# EAGLE design PortArrayModule (EAGLE 8.6.1)
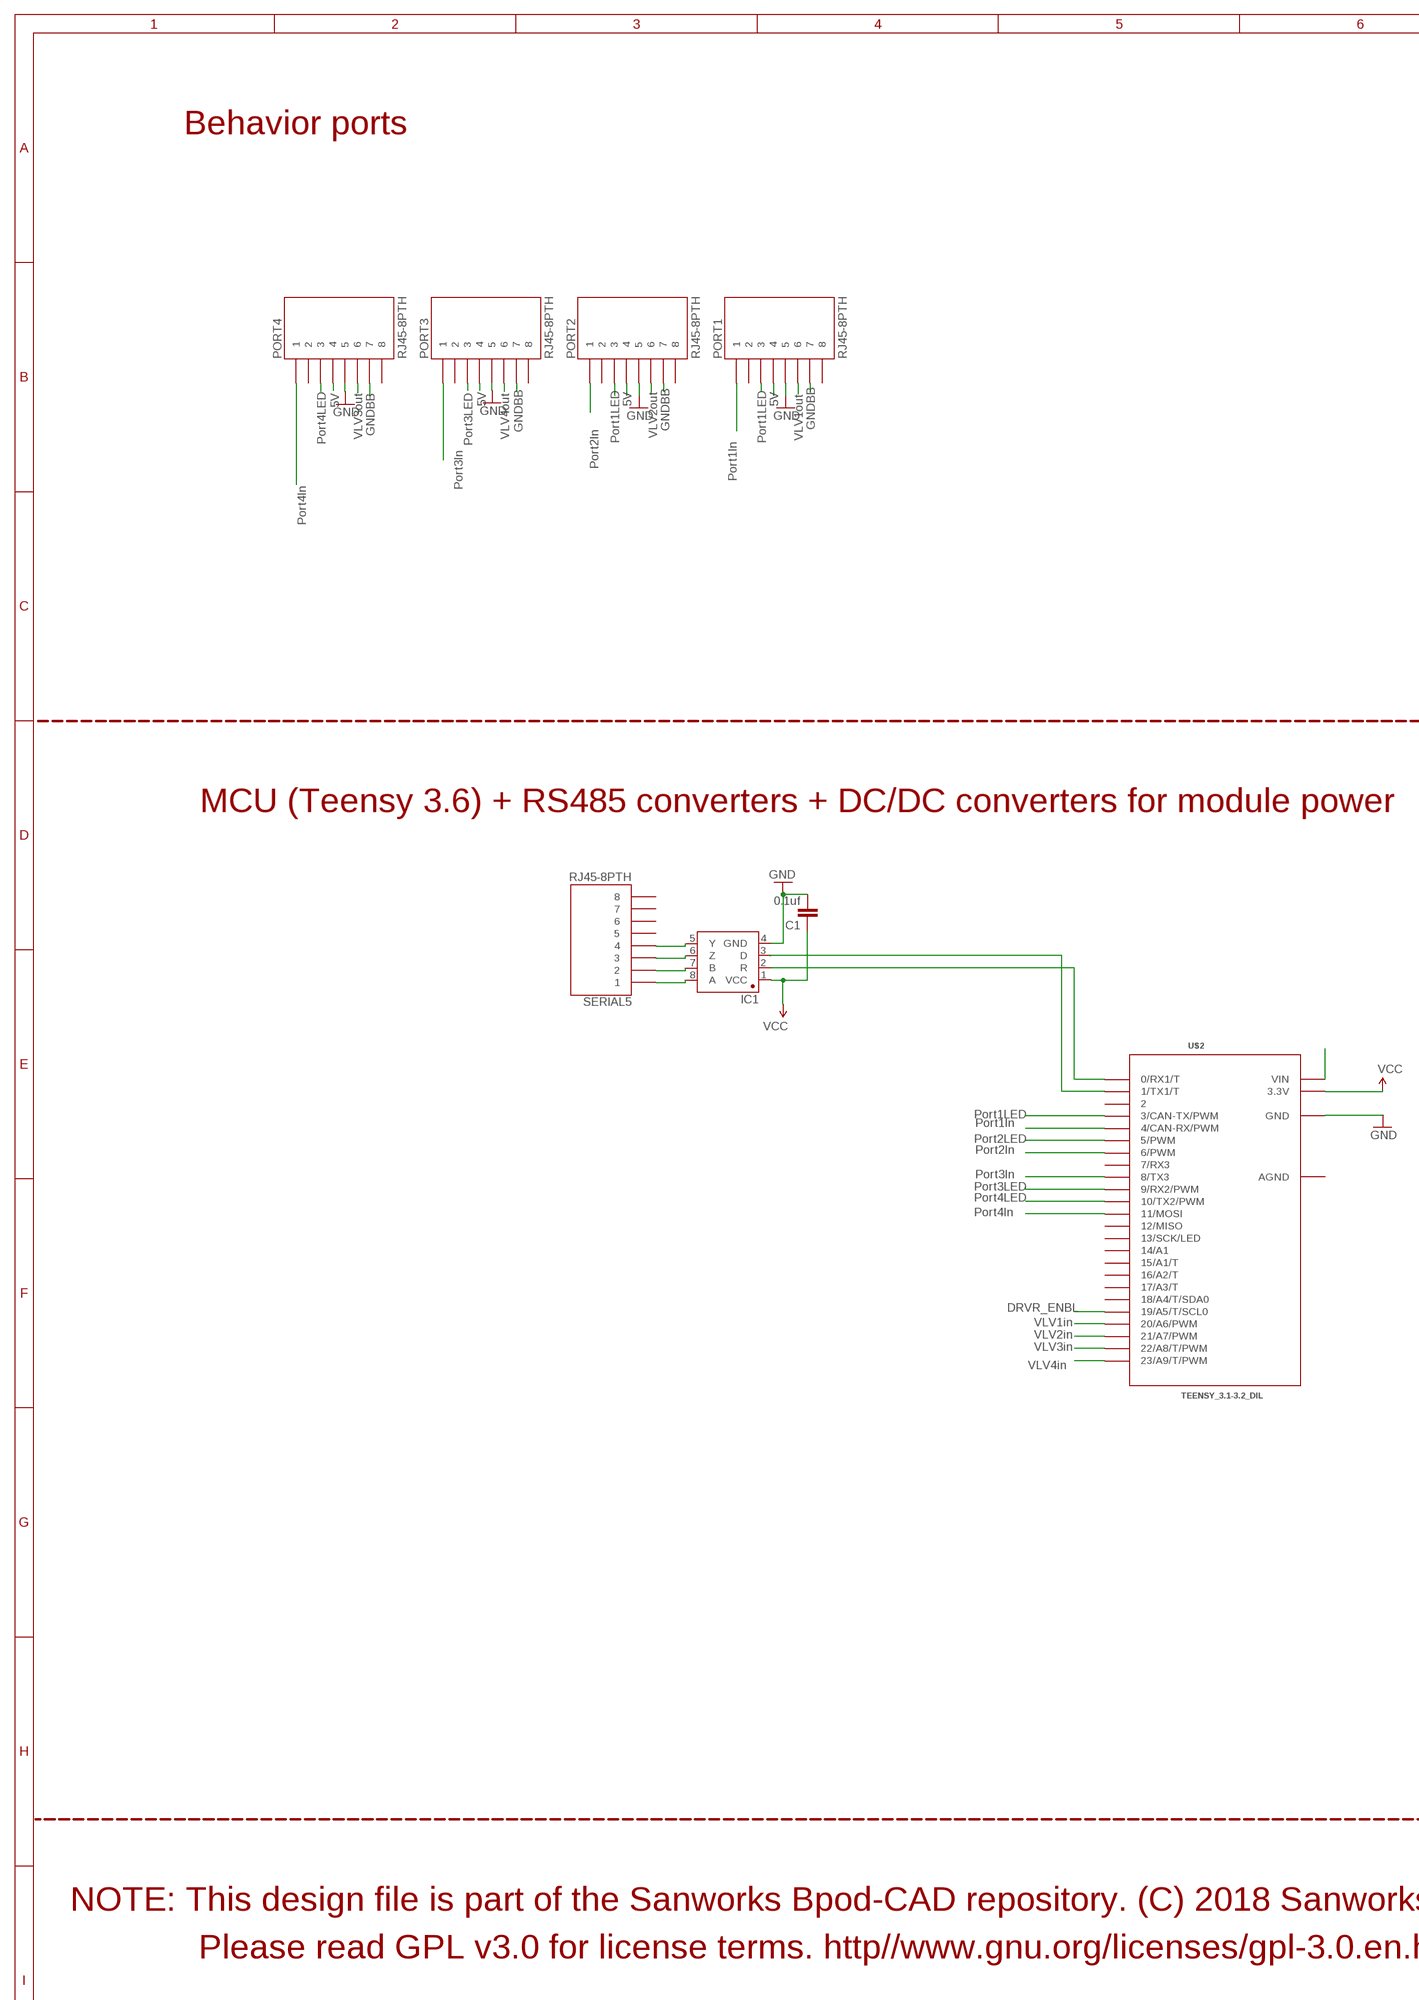
[diagram p0: schematic, sheet 1, part 1 of 2]
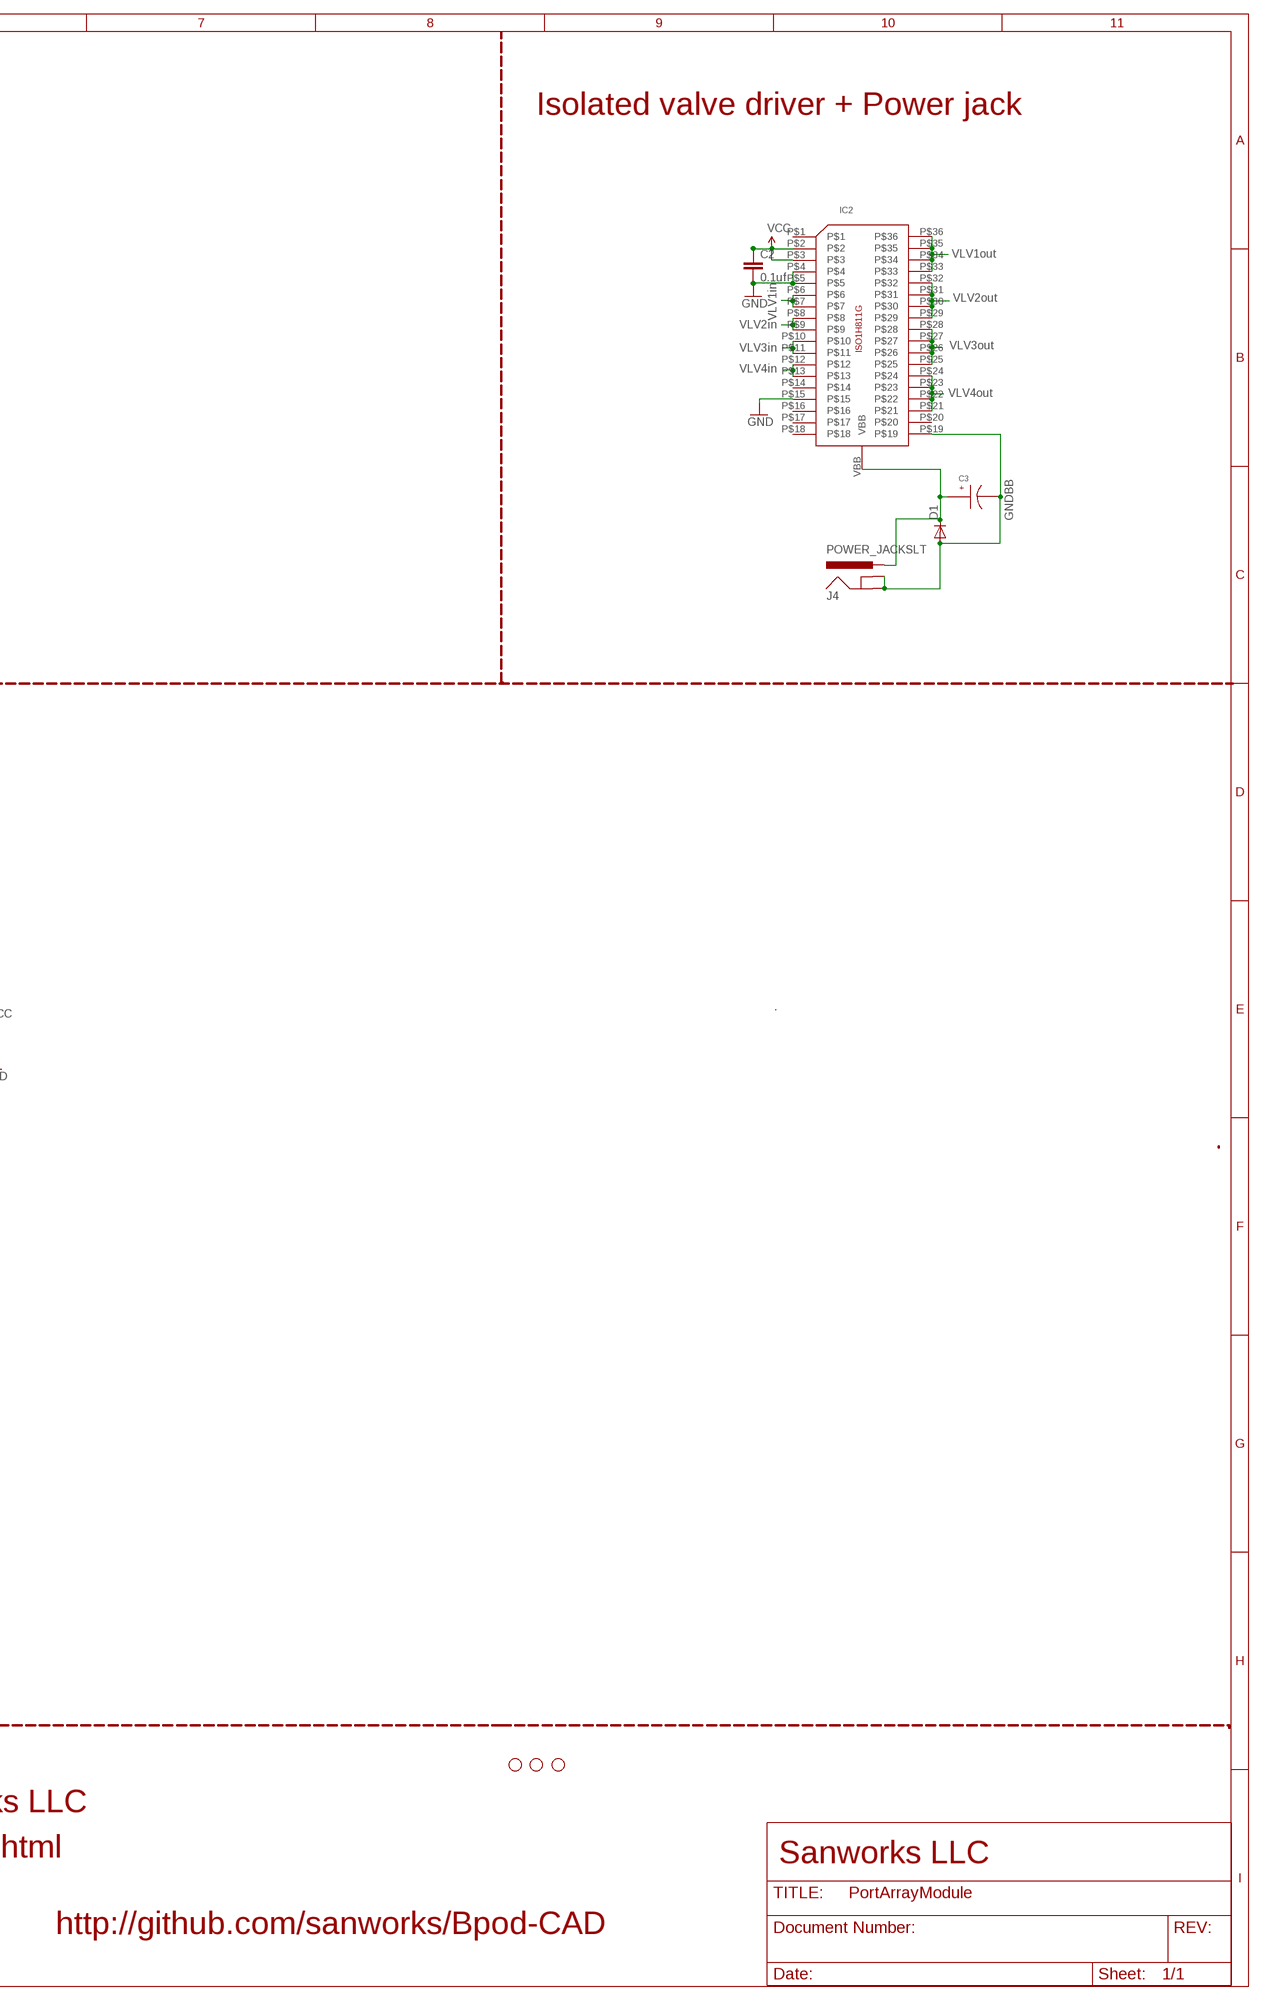
[diagram p1: schematic, sheet 1, part 2 of 2]

## Parts
C1  0.1uf  CAP1206  [1206@1]
C2  0.1uf  CAP1206  [1206@1]
C3  EEE-FK1H100UR  [EEE-FK1H100UR]
D1  DIODE-DO214AA  [DO214AA]
IC1  SN65HVD31DR  [SO08]
IC2  ISO1H811G  [ISO1H811G]
J4  POWER_JACKSLT  [POWER_JACK_SLOT]
JP3  STAND-OFF  [STAND-OFF]
JP4  STAND-OFF  [STAND-OFF]
JP5  STAND-OFF  [STAND-OFF]
PORT1  RJ45-8PTH  [RJ45-8]
PORT2  RJ45-8PTH  [RJ45-8]
PORT3  RJ45-8PTH  [RJ45-8]
PORT4  RJ45-8PTH  [RJ45-8]
SERIAL5  RJ45-8PTH  [RJ45-8]
U$2  TEENSY_3.1-3.2_DIL  [TEENSY_3.0-3.2&LC_DIL]

## Nets
5V: PORT1.4 PORT2.4 PORT3.4 PORT4.4 U$2.VIN
DRVR_ENBL: U$2.19/A5(19/A5/T/SCL0)
GND: C1.2 C2.2 IC1.4(GND) IC2.P$4 IC2.P$5 IC2.P$15 PORT1.5 PORT2.5 PORT3.5 PORT4.5 U$2.GND
GNDBB: C3.CATHODE D1.A IC2.P$19 J4.GND@1(GNDBREAK) J4.GND@2(GND) PORT1.7 PORT2.7 PORT3.7 PORT4.7
N$1: IC1.8(A) SERIAL5.1
N$2: IC1.7(B) SERIAL5.2
N$3: IC1.6(Z) SERIAL5.3
N$4: IC1.5(Y) SERIAL5.4
N$5: IC1.3(D) U$2.1(1/TX1/T)
N$6: IC1.2(R) U$2.0(0/RX1/T)
PORT1IN: PORT1.1 U$2.4(4/CAN-RX/PWM)
PORT1LED: PORT1.3 U$2.3(3/CAN-TX/PWM)
PORT2IN: PORT2.1 U$2.6(6/PWM)
PORT2LED: PORT2.3 U$2.5(5/PWM)
PORT3IN: PORT3.1 U$2.8(8/TX3)
PORT3LED: PORT3.3 U$2.9(9/RX2/PWM)
PORT4IN: PORT4.1 U$2.11(11/MOSI)
PORT4LED: PORT4.3 U$2.10(10/TX2/PWM)
VBB: C3.ANODE D1.C IC2.VBB J4.PWR
VCC: C1.1 C2.1 IC1.1(VCC) IC2.P$2 IC2.P$3 U$2.3.3V
VLV1IN: IC2.P$6 IC2.P$7 U$2.20/A6(20/A6/PWM)
VLV1OUT: IC2.P$33 IC2.P$34 IC2.P$35 IC2.P$36 PORT1.6
VLV2IN: IC2.P$8 IC2.P$9 U$2.21/A7(21/A7/PWM)
VLV2OUT: IC2.P$29 IC2.P$30 IC2.P$31 IC2.P$32 PORT2.6
VLV3IN: IC2.P$12 IC2.P$13 U$2.23/A9(23/A9/T/PWM)
VLV3OUT: IC2.P$21 IC2.P$22 IC2.P$23 IC2.P$24 PORT3.6
VLV4IN: IC2.P$10 IC2.P$11 U$2.22/A8(22/A8/T/PWM)
VLV4OUT: IC2.P$25 IC2.P$26 IC2.P$27 IC2.P$28 PORT4.6
Unconnected: IC2.P$1 IC2.P$14 IC2.P$16 IC2.P$17 IC2.P$18 IC2.P$20 PORT1.2 PORT1.8 PORT2.2 PORT2.8 PORT3.2 PORT3.8 PORT4.2 PORT4.8 SERIAL5.5 SERIAL5.6 SERIAL5.7 SERIAL5.8 U$2.2 U$2.7(7/RX3) U$2.12(12/MISO) U$2.13(13/SCK/LED) U$2.14/A0(14/A1) U$2.15/A1(15/A1/T) U$2.16/A2(16/A2/T) U$2.17/A3(17/A3/T) U$2.18/A4(18/A4/T/SDA0)

## Notes on the sheet
- Isolated valve driver + Power jack
- Behavior ports
- VLV1out
- VLV2out
- VLV1in
- VLV2in
- VLV3in | VLV3out
- VLV4in
- 5V | 5V | 5V | 5V
- VLV4out
- GNDBB | GNDBB | GNDBB
- GNDBB | VLV2out
- VLV3out | VLV4out | VLV1out
- Port4LED | Port3LED | Port1LED | Port1LED
- Port2In
- Port1In
- Port3In
- GNDBB
- Port4In
- MCU (Teensy 3.6) + RS485 converters + DC/DC converters for module power
- Port1LED
- Port1In
- Port2LED
- Port2In
- Port3In
- Port3LED
- Port4LED
- Port4In
- DRVR_ENBL
- VLV1in
- VLV2in
- VLV3in
- VLV4in
- NOTE: This design file is part of the Sanworks Bpod-CAD repository. (C) 2018 Sanworks LLC
- Please read GPL v3.0 for license terms. http//www.gnu.org/licenses/gpl-3.0.en.html | Sanworks LLC
- http://github.com/sanworks/Bpod-CAD

## Power pins joined to a net without a drawn wire
AGND: U$2.AGND

## Library data of the parts
C1 C2 = SparkFun-Capacitors:CAP: Capacitor Standard 0603 ceramic capacitor, and 0.1" leaded capacitor.
C3 = JoshParts10:EEE-FK1H100UR
D1 = diode:DIODE-: DIODE
IC1 = Joshparts4:SN65HVD31DR: A placeholder for generic narrow & wide SOIC8 foorptints - used on the DIP adapter board.
IC2 = JoshParts10:ISO1H811G
J4 = SparkFun-Connectors:POWER_JACK: Power Jack Connector This is the standard 5.5mm barrel jack for power. The PTH is the most common, proven, reliable, footprint. The Slot footprint only works if the mill layer is transmitted to the PCB fab house so be warned. Here are the connectors we sell at SparkFun: DC Barrel Power Jack/Connector <https://www.sparkfun.com/products/119> (PRT-00119) DC Barrel Power Jack/Connector (SMD) <https://www.sparkfun.com/products/12748> (PRT-12748) DC Barrel Jack Adapter - Breadboard Compatible <https://www.sparkfun.com/products/10811> (PRT-10811) It is used on this SparkFun product (and many, many others): SparkFun RedBoard - Programmed with Arduino <https://www.sparkfun.com/products/12757> (DEV-12757) Also, if you need a mating power supply or connector, please check these out: Wall Adapter Power Supply - 9VDC 650mA <https://www.sparkfun.com/products/298> (TOL-00298) DC Barrel Jack Adapter - Male <https://www.sparkfun.com/products/10287> (PRT-10287); PROD_ID: PRT-00119
JP3-JP5 = SparkFun:STAND-OFF: Stand Off This is the mechanical footprint for a #4 phillips button head screw. Use the keepout ring to avoid running the screw head into surrounding components. SKU : PRT-00447
PORT1-PORT4 SERIAL5 = SparkFun:RJ45-8: RJ45 Jack Simple RJ45, 8-pin connection - connector for common Cat5, Cat5e, and Cat6 Ethernet cables. Footprint not yet proven in production. Connector sku is PRT-00643; Breakout PCB sku is BOB-00716.
U$2 = Teensy_3_and_LC_Series_Boards_v1.4:TEENSY_3.1-3.2_DIL: Teensy 3.1 or 3.2 in a DIL Layout.

## Net classes
0 default: width 0.254 mm, clearance 0.254 mm

## Board
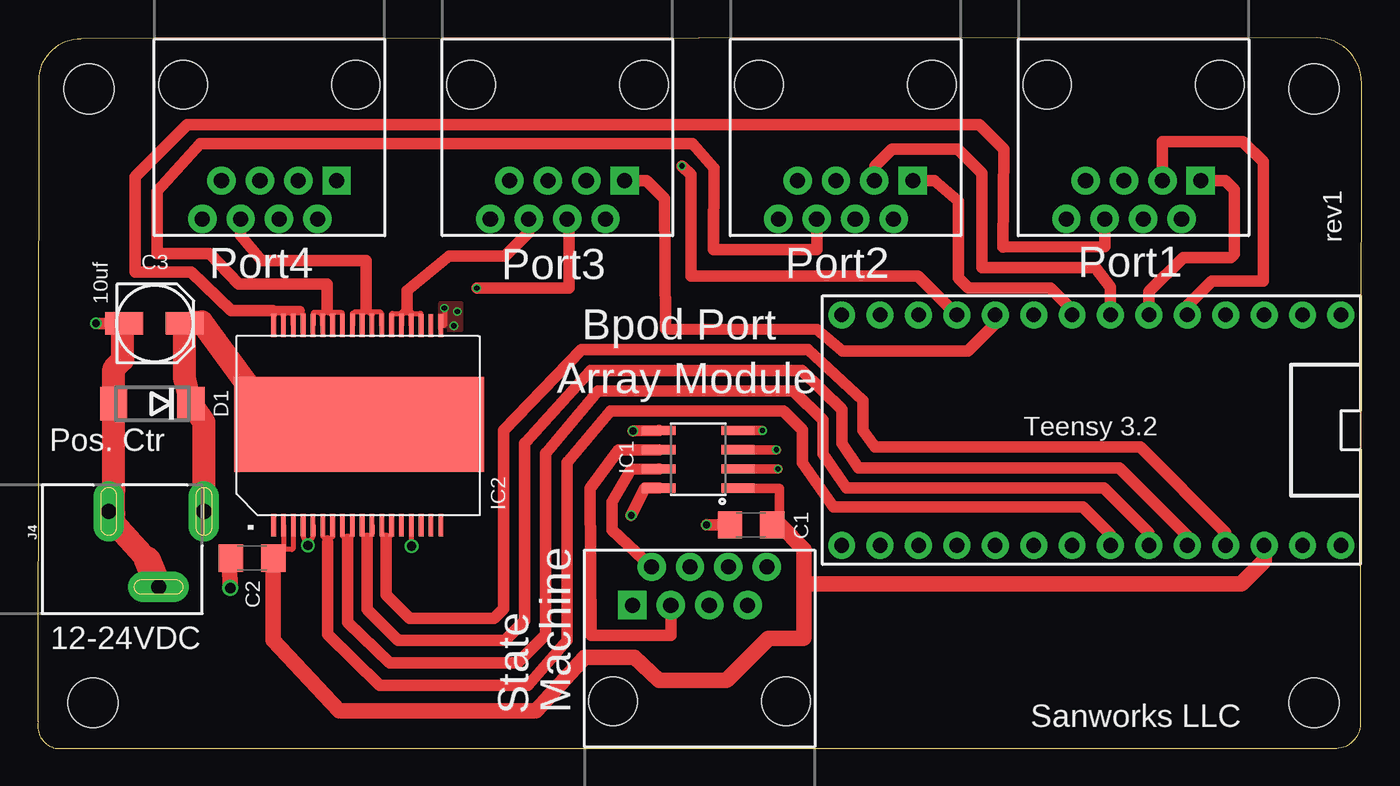
[diagram p2: board, top side]
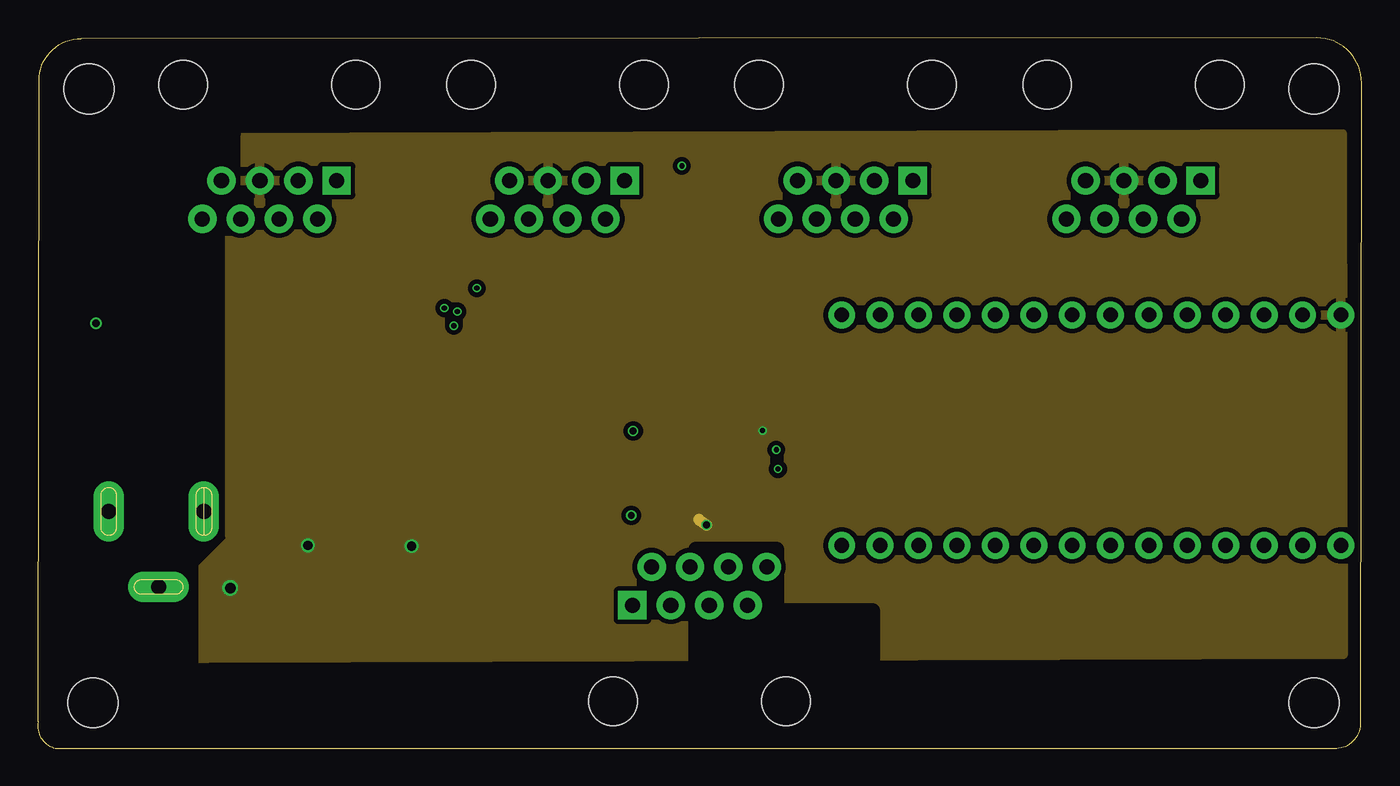
[diagram p3: board, inner layer Route2]
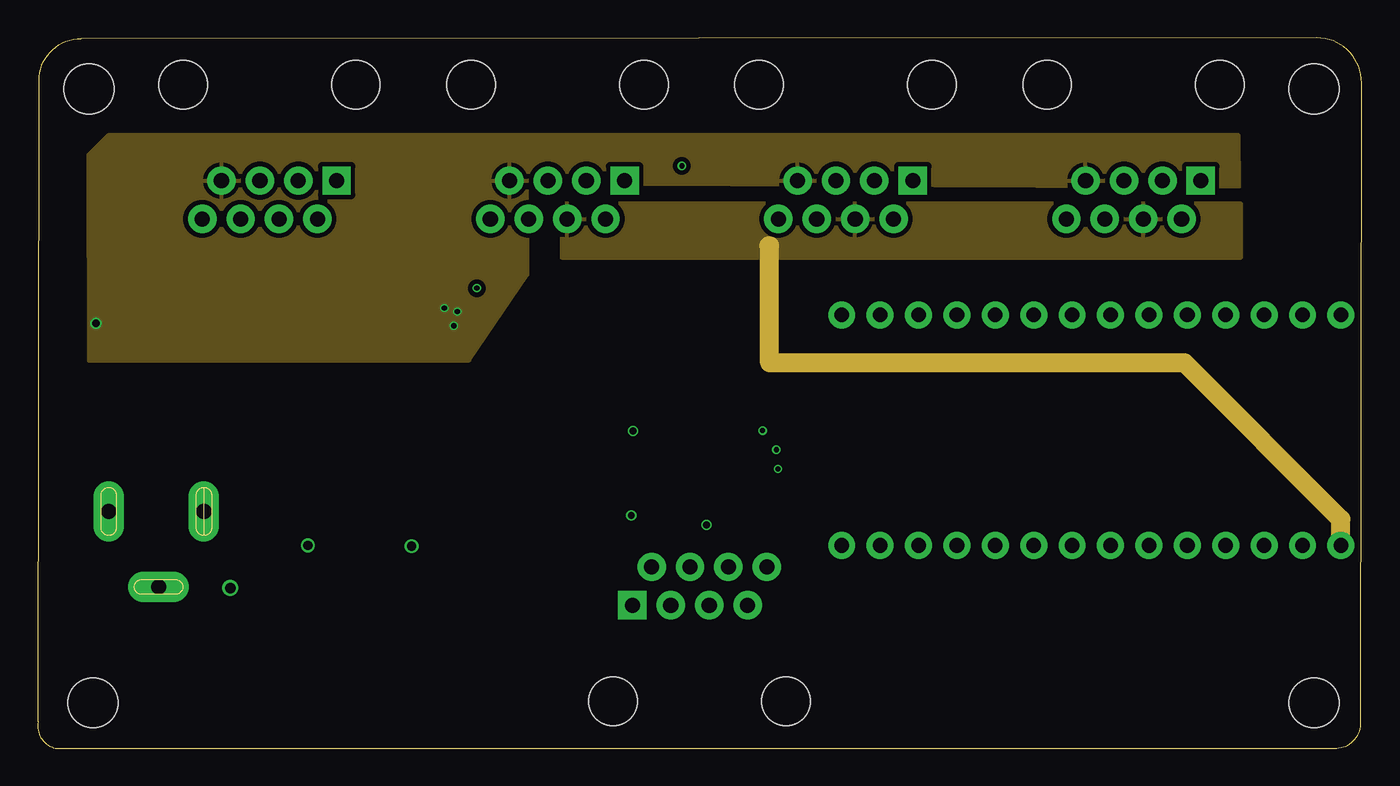
[diagram p4: board, inner layer Route15]
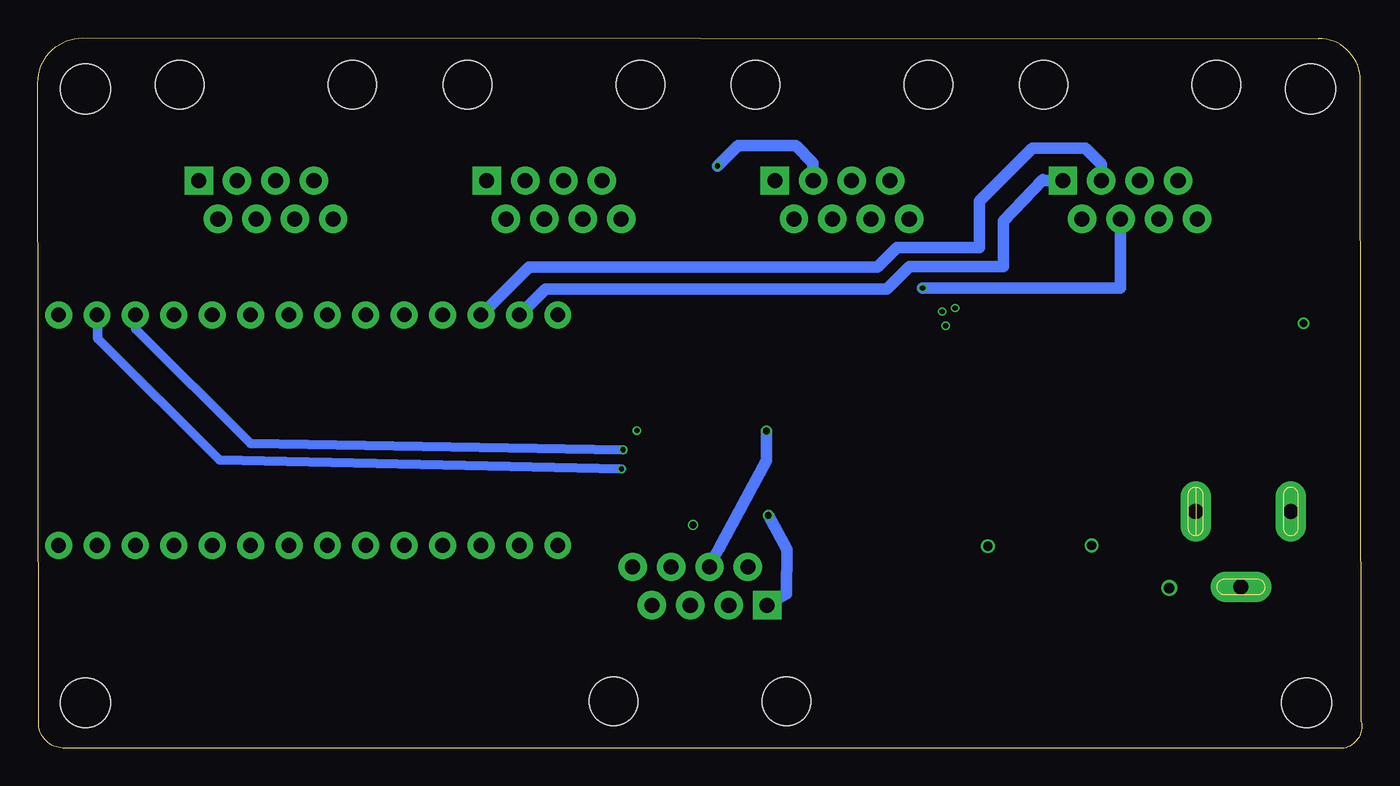
[diagram p5: board, bottom side, seen from below]

Size 87.56 x 46.99 mm. Coordinates in mm from the lower left corner, seen from the top.
Outline: 0.03,1.73 0.08,44.15 arc-90 2.87,46.94 84.59,46.99 arc-90 87.56,44.03 87.51,1.73 arc-90 85.89,0 1.17,0 arc-90 0.03,1.73
Copper layers (1*2*15*16): Top 0.035mm / dielectric 0.2mm / Route2 0.0175mm / dielectric 0.3mm / Route15 0.0175mm / dielectric 0.2mm / Bottom 0.035mm
Design rules "SeeedStudio_4layer_DRU_no_angle_20140221 *": minimum track width 8mil, minimum drill 12mil, track to track 12mil, track to pad 12mil, pad to pad 12mil, via to via 12mil, smd to smd 0mil, copper to edge 10mil, drill to drill 8mil, minimum pad ring 6mil, minimum via ring 4mil, stop-mask expansion 4mil, vias tented up to drill 25mil, thermal gap 10mil

### Footprints (pad centres in the part's own frame; a part is rotated, then mirrored left to right if it is on the bottom)
1206@1 = smd 1.6 x 1.8: 1 -1.4,0; 2 1.4,0
EEE-FK1H100UR = smd 1.5 x 2.5: ANODE 0,4; CATHODE 0,0
DO214AA = smd 1.8 x 2.2: A 2.55,0; C -2.55,0
SO08 = smd 0.61 x 2.21: 1 -1.905,-2.616; 2 -0.635,-2.616; 3 0.635,-2.616; 4 1.905,-2.616; 5 1.905,2.616; 6 0.635,2.616; 7 -0.635,2.616; 8 -1.905,2.616
ISO1H811G = smd 1.5 x 0.305: P$1 0,11.05; P$2 0,10.4; P$3 0,9.75; P$4 0,9.1; P$5 0,8.45; P$6 0,7.8; P$7 0,7.15; P$8 0,6.5; P$9 0,5.85; P$10 0,5.2; P$11 0,4.55; P$12 0,3.9; P$13 0,3.25; P$14 0,2.6; P$15 0,1.95; P$16 0,1.3; P$17 0,0.65; P$18 0,0; P$19 13.2,0; P$20 13.2,0.65; P$21 13.2,1.3; P$22 13.2,1.95; P$23 13.2,2.6; P$24 13.2,3.25; P$25 13.2,3.9; P$26 13.2,4.55; P$27 13.2,5.2; P$28 13.2,5.85; P$29 13.2,6.5; P$30 13.2,7.15; P$31 13.2,7.8; P$32 13.2,8.45; P$33 13.2,9.1; P$34 13.2,9.75; P$35 13.2,10.4; P$36 13.2,11.05 | smd 6.3 x 16.51: VBB 6.65,5.4
POWER_JACK_SLOT = drill 1 pad 2 long: GND@1 2.58,7.5; GND@2 7.58,10.8; PWR 2.58,13.8
STAND-OFF = hole 3.302: 0,0
RJ45-8 = drill 1 pad 1.88 square: 1 -4.445,6.35 | drill 1 pad 1.88: 2 -3.175,8.89; 3 -1.905,6.35; 4 -0.635,8.89; 5 0.635,6.35; 6 1.905,8.89; 7 3.175,6.35; 8 4.445,8.89 | hole 3.2: -5.715,0; 5.715,0
TEENSY_3.0-3.2&LC_DIL = drill 0.965 pad 1.778: 0 -7.62,13.97; 1 -7.62,11.43; 2 -7.62,8.89; 3 -7.62,6.35; 3.3V 7.62,11.43; 4 -7.62,3.81; 5 -7.62,1.27; 6 -7.62,-1.27; 7 -7.62,-3.81; 8 -7.62,-6.35; 9 -7.62,-8.89; 10 -7.62,-11.43; 11 -7.62,-13.97; 12 -7.62,-16.51; 13 7.62,-16.51; 14/A0 7.62,-13.97; 15/A1 7.62,-11.43; 16/A2 7.62,-8.89; 17/A3 7.62,-6.35; 18/A4 7.62,-3.81; 19/A5 7.62,-1.27; 20/A6 7.62,1.27; 21/A7 7.62,3.81; 22/A8 7.62,6.35; 23/A9 7.62,8.89; AGND 7.62,13.97; GND -7.62,16.51; VIN 7.62,16.51

### Placement (x,y rotation side)
C1  47.17,14.76 180 top
C2  14.18,12.57 180 top
C3  5.72,28.09 270 top
D1  7.57,22.78 180 top
IC1  43.69,19.1 90 top
IC2  26.65,14.76 90 top
J4  -2.81,18.24 270 top
JP1  STAND-OFF  [STAND-OFF]  3.64,3 0 top
JP3  3.38,43.62 0 top
JP4  84.41,43.62 0 top
JP5  84.41,3 0 top
PORT1  72.47,43.89 180 top
PORT2  53.42,43.89 180 top
PORT3  34.37,43.89 180 top
PORT4  15.32,43.89 180 top
SERIAL5  43.77,3.1 0 top
U$2  69.68,21.03 270 top

### Tracks (layer width: path | path; a pad name or v marks a point on that pad's centre or on a via)
5V  (via drill 0.35)
  Top 0.762: v29.04,30.43 35.13,30.43 35.13,35 PORT3.4
  Route15 1.27: U$2.VIN 86.19,15.14 75.85,25.48 48.39,25.48 48.39,33.22 48.34,33.22
  Bottom 0.762: PORT4.4 15.96,30.43 v29.04,30.43
  pour Route15: 34.62,36.02 34.62,32.46 79.58,32.46 79.58,36.02
GND  (via drill 0.35, 0.45, 0.6, 0.7)
  Top 0.318: IC2.P$4 17.55,13.98 v17.86,13.41 18.2,14 IC2.P$5 | IC2.P$15 24.7,13.46 v24.72,13.36
  Top 0.635: IC1.4 v47.93,21.01
  Top 0.762: C1.2 v44.23,14.76
  Top 1.016: C2.2 12.7,12.01 v12.73,10.59
  Route2 0.762: v44.23,14.76 43.77,15.06 43.74,15.14
  Bottom 0.318: v17.86,13.41 17.91,13.67 17.96,13.61 | v24.72,13.36 24.72,13.16 24.82,13.26
  pour Route2: 1.91,5.89 1.86,40.34 86.29,40.64 86.34,6.2
GNDBB  (via drill 0.35, 0.5)
  Top 0.318: IC2.P$19 26.9,27.96 26.9,28.96
  Top 0.762: C3.CATHODE v3.84,28.09
  Top 1.27: 5.62,27.99 C3.CATHODE
  Top 1.524: 7.25,12.44 5.06,14.88 5.02,15.51 5.02,17.1 | 5.02,17.1 D1.A 5.02,25.11 5.62,25.71 5.62,27.99 | J4.GND@1 5.02,17.1
  Top 1.778: J4.GND@2 7.25,12.44
  other vias: 26.88,29.11 27.74,28.88 27.51,27.94
  pour Route15: 3.33,39.22 3.38,25.63 12.78,25.63 12.78,25.65 28.53,25.65 32.39,31.32 32.36,37.36 79.46,37.13 79.43,40.54 4.65,40.54
  pour Top: 27.97,27.69 26.65,27.69 26.65,29.41 27.97,29.41
N$1  (via drill 0.45)
  Top 0.762: v39.25,15.39 40.16,17.2 IC1.8
  Bottom 0.762: v39.25,15.39 38,13.16 38.05,10.21 39.25,9.53 SERIAL5.1
N$2
  Top 0.762: SERIAL5.2 37.98,14.43 37.98,16.28 39.22,18.44 IC1.7
N$3
  Top 0.762: SERIAL5.3 41.86,7.44 36.58,7.44 36.53,17.17 38.41,19.74 IC1.6
N$4  (via drill 0.45)
  Top 0.762: v39.37,20.98 IC1.5
  Bottom 0.762: SERIAL5.4 43.18,12.01 42.52,13.16 39.37,19.02 v39.37,20.98
N$5  (via drill 0.35)
  Top 0.635: IC1.3 v48.85,19.74
  Bottom 0.635: v48.85,19.74 73.49,20.14 81.08,27.74 81.08,28.63 U$2.1
N$6  (via drill 0.35)
  Top 0.635: IC1.2 v48.95,18.47
  Bottom 0.635: v48.95,18.47 75.54,19.05 83.6,27.1 83.6,28.6 U$2.0
N$7
  cutout Route2: 43.51,5.79 43.51,13.16 48.85,13.16 48.85,5.79
N$8
  cutout Route2: 49.86,9.09 55.2,9.09 55.2,6.05 54.94,6.3 49.86,6.3
N$9
  cutout Route2: 10.49,5.54 10.49,12.14 12.27,13.92 12.27,35.76 13.29,36.78 13.29,40.59 1.1,40.59 1.1,5.54
PORT1IN
  Top 0.762: U$2.4 73.49,30.2 75.75,32.46 78.9,32.46 79.13,32.69 79.13,36.96 78.54,37.54 PORT1.1
PORT1LED
  Top 0.762: U$2.3 76.03,29.26 77.65,30.89 81.03,30.89 81.06,30.91 81.06,38.79 79.71,40.13 74.38,40.13 PORT1.3
PORT2IN
  Top 0.762: U$2.6 68.41,28.98 66.96,30.43 61.55,30.43 60.89,31.09 60.89,36.2 59.29,37.54 PORT2.1
PORT2LED
  Top 0.762: U$2.5 70.95,30.51 69.96,31.78 62.44,31.78 62.44,38.05 60.86,39.62 56.49,39.62 55.38,38.51 55.38,37.59 PORT2.3
PORT3IN
  Top 0.762: PORT3.1 40.26,37.54 41.46,36.35 41.51,27.71 51.52,27.69 53.22,26.26 61.5,26.26 63.33,28.09 U$2.8
PORT3LED  (via drill 0.35)
  Top 0.762: v42.6,38.51 42.6,38.48 42.63,38.48 43.18,37.92 43.18,31.22 58.22,31.22 U$2.9
  Bottom 0.762: v42.6,38.51 41.25,39.85 37.42,39.85 36.28,38.71 PORT3.3
PORT4IN
  Bottom 0.762: U$2.11 53.98,30.38 31.4,30.38 29.93,31.85 23.7,31.85 23.7,34.87 21.09,37.62 21.01,37.54 PORT4.1
PORT4LED
  Bottom 0.762: U$2.10 55.07,31.83 32.03,31.83 30.74,33.12 25.28,33.12 25.28,36.17 21.77,39.68 18.27,39.68 17.23,38.63 PORT4.3
VBB
  Top 1.524: IC2.VBB 15.81,21.41 10.85,28.19 C3.ANODE 9.72,24.34 D1.C 10.98,21.57 J4.PWR
VCC
  Top 0.318: IC2.P$2 16.25,13.14 | 16.25,13.14 C2.1 | IC2.P$3 16.9,13.21 16.82,13.13 16.81,13.14 16.25,13.14
  Top 0.635: C1.1 49.05,14.76 49.05,17.17 47.4,17.17 IC1.1
  Top 1.016: C2.1 15.57,7.14 19.92,2.46 32.96,2.46 36.16,6.02 39.47,6.02 41.09,4.5 45.55,4.5 48.32,7.26 50.65,7.26 50.68,7.29 50.68,10.87 | C1.1 49.08,14.76 50.68,13.16 50.68,10.87 | U$2.3.3V 81.11,12.4 79.58,10.87 50.68,10.87
  Top 1.27: C2.1
VLV1IN
  Top 0.318: IC2.P$6 18.85,14 19.18,13.61 | IC2.P$7 19.5,13.98 19.18,13.77
  Top 0.635: 19.18,13.61 19.18,13.77
  Top 0.762: U$2.20/A6 70.95,14.12 69.12,15.95 52.61,15.95 50.58,18.87 50.58,21.06 49.33,22.3 37.88,22.3 35.06,18.95 35.01,18.9 35.01,7.14 32.41,4.17 22.61,4.17 19.18,7.52 19.18,13.61
VLV1OUT
  Top 0.318: IC2.P$33 17.55,28.71 17.35,28.96 16.79,28.8 16.9,28.65 16.84,28.65 | 16.84,28.65 16.69,28.8 16.44,28.8 16.29,28.65 16.13,28.75 | 16.13,28.75 15.93,28.8 15.78,28.8 15.6,28.63 IC2.P$36 | IC2.P$35 16.25,28.59 16.13,28.75 | IC2.P$34 16.9,28.6 16.84,28.65
  Top 0.635: 15.52,28.96 17.35,28.96
  Top 0.762: 15.52,28.96 12.78,28.96 10.14,31.5 6.43,31.5 6.43,37.8 9.88,41.25 62.26,41.25 63.89,39.62 63.83,33.15 70.57,33.17 PORT1.6
VLV2IN
  Top 0.318: IC2.P$8 20.15,14.02 20.5,13.82 20.8,14.06 IC2.P$9
  Top 0.762: U$2.21/A7 73.49,14.22 70.51,17.2 53.5,17.2 51.92,19.46 51.92,21.69 49.99,23.62 37.06,23.62 33.63,19.56 33.58,19.51 33.58,7.49 31.73,5.64 23.27,5.64 20.5,8.31 20.5,13.82
VLV2OUT
  Top 0.318: IC2.P$29 20.15,28.75 20.1,28.8 19.59,28.8 | 19.59,28.8 19.49,28.7 | 19.49,28.7 19.38,28.7 19.28,28.8 | 19.28,28.8 19.18,28.8 | 19.18,28.8 18.98,28.8 | 18.98,28.8 18.88,28.7 | 18.88,28.7 18.72,28.7 18.62,28.8 18.22,28.8 18.22,28.03 IC2.P$32 | IC2.P$31 18.85,28.67 18.88,28.7 | IC2.P$30 19.5,28.69 19.49,28.7 | 19.59,28.8 19.28,28.8 | 18.98,28.8 18.27,28.8 | 19.13,29.06 19.13,28.85 19.18,28.8
  Top 0.762: 19.13,29.06 19.13,30.68 13.29,30.68 11.36,32.72 7.9,32.72 7.9,36.83 10.75,39.98 43.31,39.98 44.73,38.35 44.68,32.97 51.54,32.97 51.54,34.98 PORT2.6
VLV3IN
  Top 0.318: IC2.P$12 22.75,14.06 23.04,13.87 23.4,14.07 IC2.P$13
  Top 0.762: 23.04,13.87 23.04,10.13 24.59,8.59 30.18,8.59 30.81,9.22 30.81,21.02 35.97,26.38 50.92,26.38 54.57,22.99 54.57,21.02 55.35,19.91 72.9,19.91 78.57,14.25 U$2.23/A9
VLV3OUT
  Top 0.318: IC2.P$24 23.4,28.7 23.45,28.75 24.01,28.75 24.06,28.7 IC2.P$23 | IC2.P$22 24.7,28.73 24.72,28.75 25.28,28.75 25.33,28.7 25.33,27.98 IC2.P$21 25.35,28.73 25.33,28.75
  Top 0.508: 24.06,28.7 24.26,28.91 24.41,29.01 24.41,29.02 24.7,28.73
  Top 0.762: PORT3.6 32.47,34.11 30.92,32.56 27.21,32.56 24.41,30.25 24.41,29.01
VLV4IN
  Top 0.318: IC2.P$10 21.45,14.14 21.77,13.87 22.1,14.14 IC2.P$11
  Top 0.635: U$2.22/A8 76.03,14.05
  Top 0.762: 76.03,14.05 71.53,18.54 54.26,18.54 53.19,20.17 53.19,22.4 50.52,24.97 36.55,24.97 32.29,20.24 32.19,20.14 32.19,8.41 30.89,7.11 23.83,7.11 21.77,9.17 21.77,13.87
VLV4OUT
  Top 0.318: IC2.P$25 22.75,28.74 22.64,28.85 21.87,28.85 | 22.23,28.85 22.13,28.75 | 22.13,28.75 21.98,28.75 21.87,28.85 | 21.87,28.85 21.72,28.85 | 21.72,28.85 21.62,28.85 | 21.62,28.85 21.47,28.7 21.42,28.7 | 21.42,28.7 21.26,28.85 | 21.26,28.85 20.96,28.85 20.81,28.75 IC2.P$28 | IC2.P$27 21.45,28.67 21.42,28.7 | IC2.P$26 22.1,28.72 22.13,28.75 | 21.62,28.85 21.26,28.85 | 21.72,29.11 21.72,28.85
  Top 0.762: 21.72,29.11 21.72,32.26 14.81,32.26 13.42,33.91 PORT4.6

### Text on the board
tPlace: rev1 | Port4 | Port3 | Port2 | Port1 | 10uf | Bpod Port | Array Module | Teensy 3.2 | Pos. Ctr | IC2 | Machine | State | 12-24VDC | Sanworks LLC